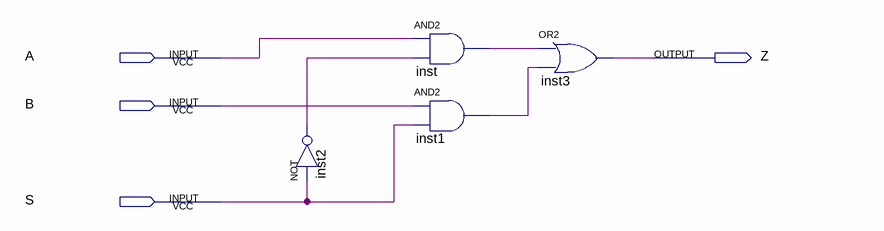
[diagram p0: schematic sheet]
// Quartus schematic SE12.bdf as structural Verilog: 4 symbols, 4 pins
module SE12 (
  input  A,
  input  B,
  input  S,
  output Z
);

  wire inst1_out, inst2_out, inst_out;

  not inst2 (inst2_out, S);
  and inst (inst_out, A, inst2_out);
  and inst1 (inst1_out, B, S);
  or inst3 (Z, inst_out, inst1_out);
endmodule
